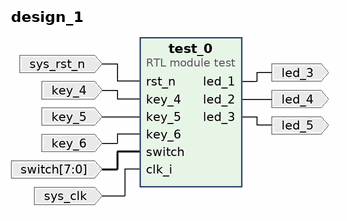
[diagram p0: block diagram of the top level]
# Vivado block design design_1, xc7k325tffg676-1, Vivado 2019.1
create_bd_design design_1

create_bd_port -dir I sys_rst_n
create_bd_port -dir I key_4
create_bd_port -dir I key_5
create_bd_port -dir I key_6
create_bd_port -dir O led_3
create_bd_port -dir I -from 7 -to 0 switch
create_bd_port -dir I sys_clk
create_bd_port -dir O led_4
create_bd_port -dir O led_5

create_bd_cell -type module -reference test test_0

# ---- connections ----

connect_bd_net [get_bd_ports sys_rst_n] [get_bd_pins test_0/rst_n]
connect_bd_net -net key_4_1 [get_bd_ports key_4] [get_bd_pins test_0/key_4]
connect_bd_net -net key_5_1 [get_bd_ports key_5] [get_bd_pins test_0/key_5]
connect_bd_net -net key_6_1 [get_bd_ports key_6] [get_bd_pins test_0/key_6]
connect_bd_net [get_bd_ports switch] [get_bd_pins test_0/switch]
connect_bd_net [get_bd_ports sys_clk] [get_bd_pins test_0/clk_i]
connect_bd_net [get_bd_pins test_0/led_1] [get_bd_ports led_3]
connect_bd_net [get_bd_pins test_0/led_2] [get_bd_ports led_4]
connect_bd_net [get_bd_pins test_0/led_3] [get_bd_ports led_5]

validate_bd_design
save_bd_design
